# EAGLE design TutorialA (EAGLE 7.3.0)
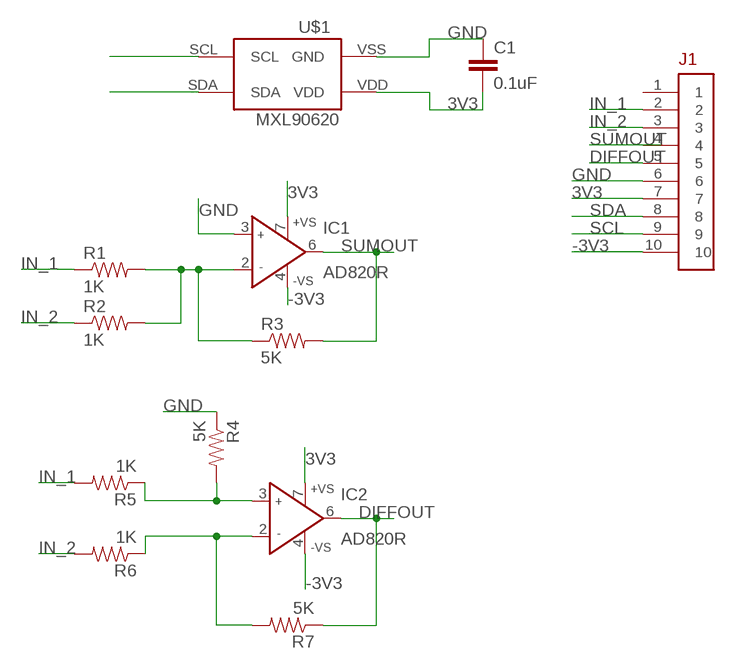
[diagram p0: schematic, sheet 1]

## Parts
C1  0.1uF  CAP0805  [0805]
IC1  AD820R  [SO8]
IC2  AD820R  [SO8]
J1  M50-3120545  [10PINFEMALE]
R1  1K  RESISTOR  [0805]
R2  1K  RESISTOR  [0805]
R3  5K  RESISTOR  [0805]
R4  5K  RESISTOR  [0805]
R5  1K  RESISTOR  [0805]
R6  1K  RESISTOR  [0805]
R7  5K  RESISTOR  [0805]
U$1  MXL90620  [MXL90620]

## Nets
3V3: C1.2 IC1.7(+VS) IC2.7(+VS) J1.7 U$1.VDD
-3V3: IC1.4(-VS) IC2.4(-VS) J1.10
DIFFOUT: IC2.6(OUT) J1.5 R7.1
GND: C1.1 IC1.3(IN+) J1.6 R4.1 U$1.VSS(GND)
IN_1: J1.2 R1.1 R5.2
IN_2: J1.3 R2.1 R6.2
N$1: IC1.2(IN-) R1.2 R2.2 R3.1
N$2: IC2.3(IN+) R4.2 R5.1
N$3: IC2.2(IN-) R6.1 R7.2
SCL: J1.9 U$1.SCL
SDA: J1.8 U$1.SDA
SUMOUT: IC1.6(OUT) R3.2
Unconnected: J1.1 J1.4

## Library data of the parts
C1 = CNTRL_BOARD:CAP: Capacitor Standard 0603 ceramic capacitor, and 0.1" leaded capacitor.
IC1 IC2 = analog-devices:AD820: Single-Supply, Rail-to-Rail, Low Power, FET Input Op Amp Source: http://www.analog.com/static/imported-files/data_sheets/AD820.pdf; OC_FARNELL: 1838867; OC_NEWARK: unknown
J1 = LED_Driver_Board:M50-3120545
R1-R7 = CNTRL_BOARD:RESISTOR
U$1 = CNTRL_BOARD:MXL90620

## Board
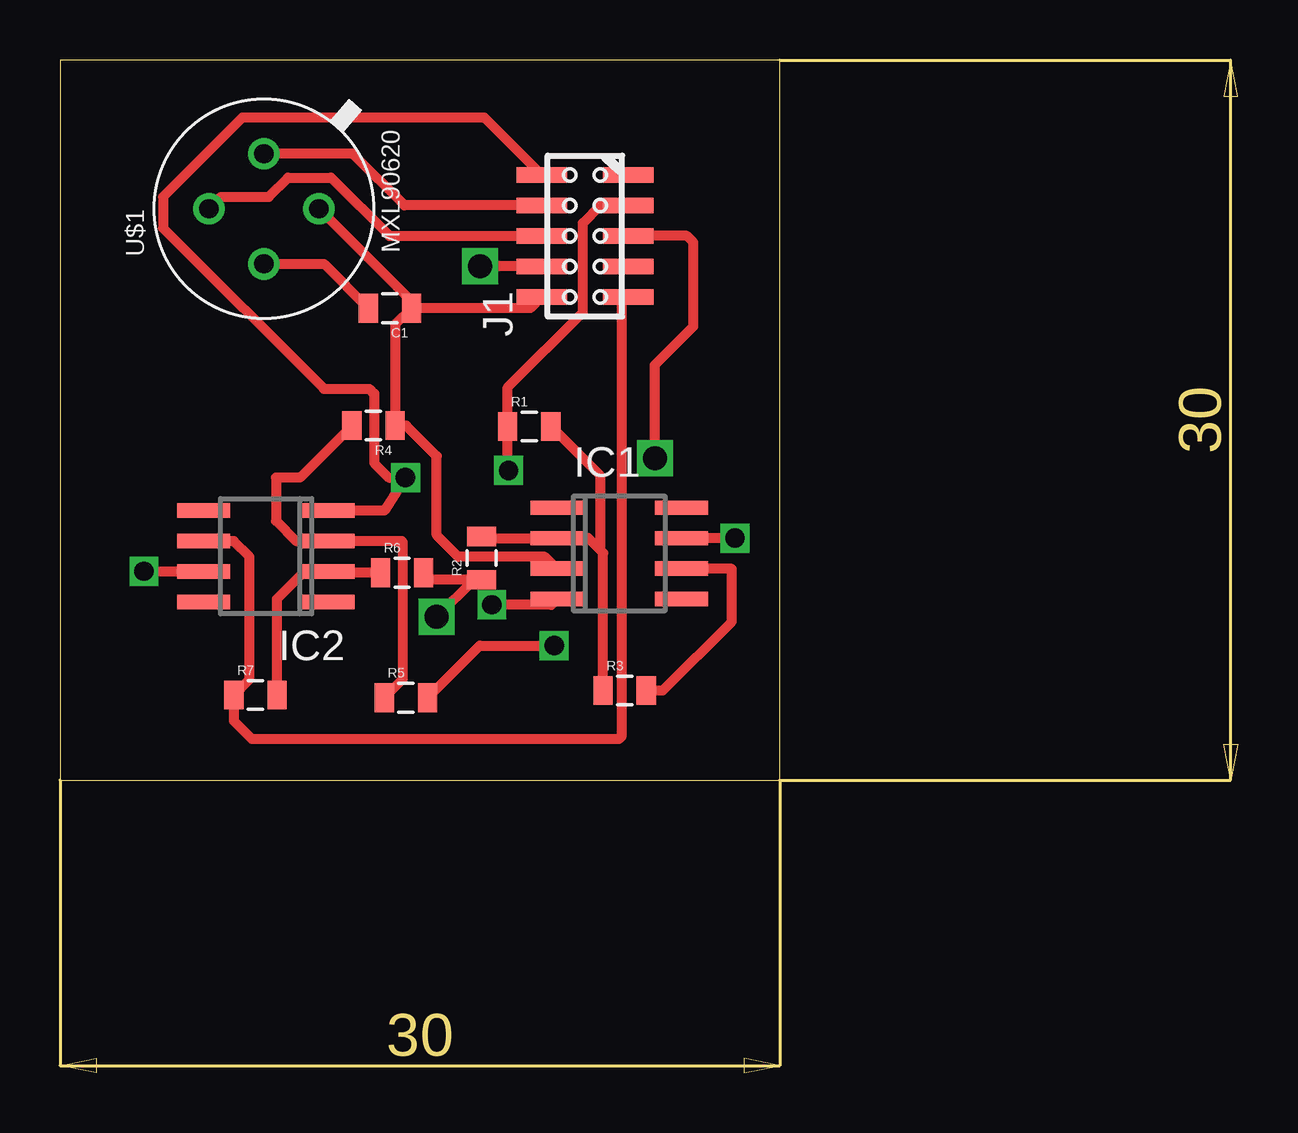
[diagram p1: board, top side]
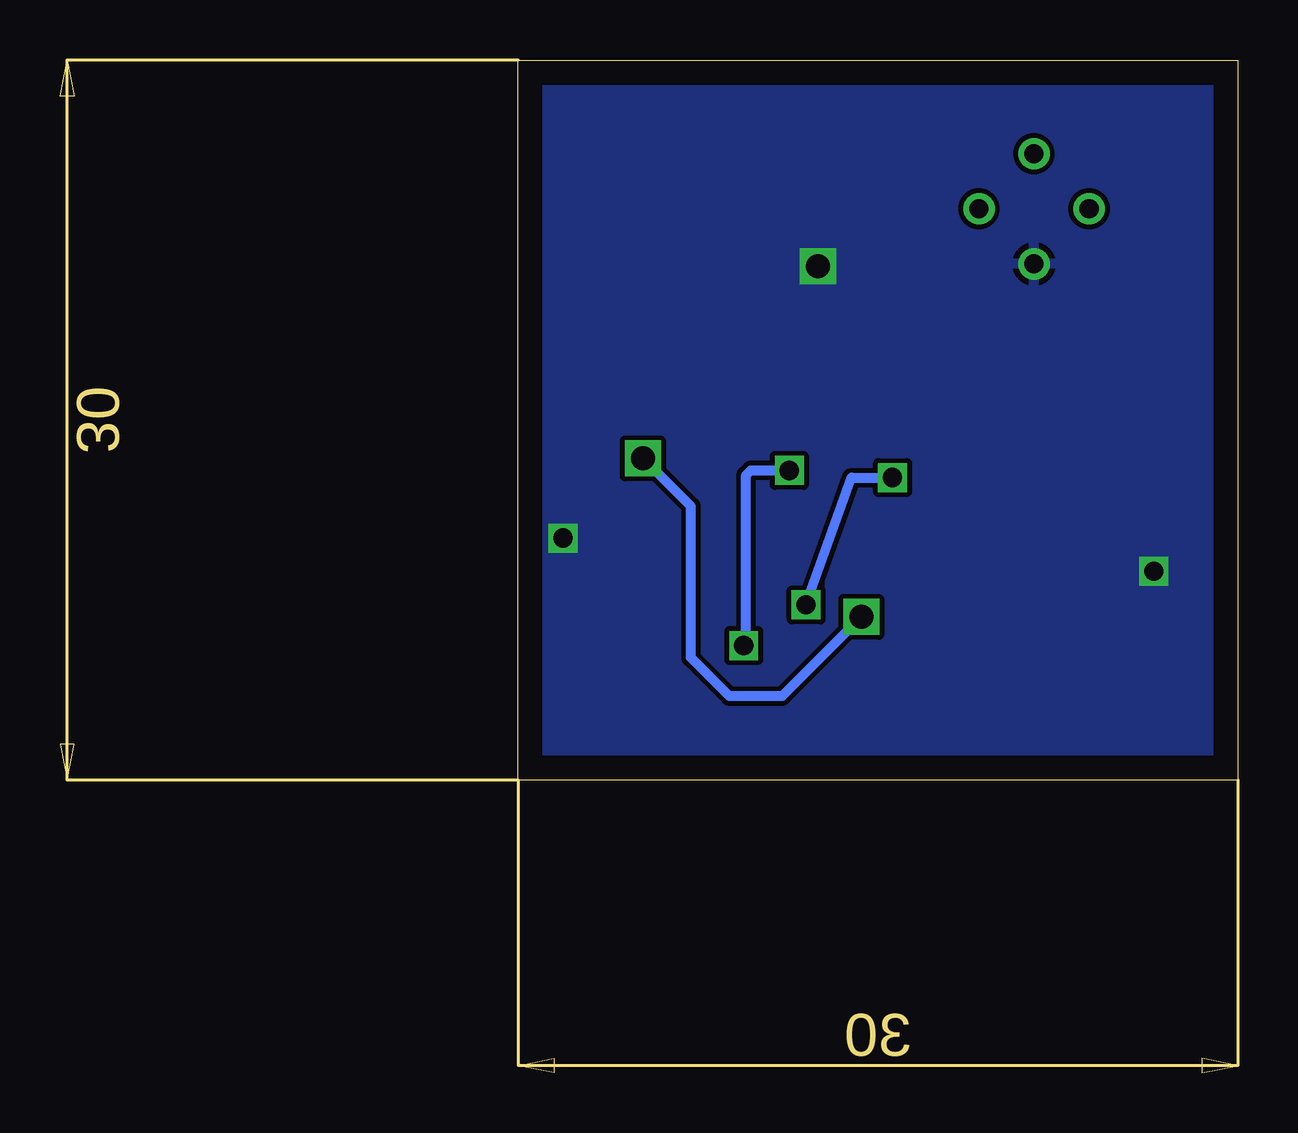
[diagram p2: board, bottom side, seen from below]

Size 30 x 30 mm. Coordinates in mm from the lower left corner, seen from the top.
Outline: 0,0 30,0 30,30 0,30 0,0
Copper layers (1*16): Top 0.035mm / dielectric 1.5mm / Bottom 0.035mm
Design rules "default": minimum track width 10mil, minimum drill 24mil, track to track 8mil, track to pad 8mil, pad to pad 8mil, via to via 8mil, smd to smd 8mil, copper to edge 40mil, drill to drill 8mil, minimum pad ring 10mil, minimum via ring 8mil, stop-mask expansion 4mil, vias tented up to drill 0mil, thermal gap 10mil

### Footprints (pad centres in the part's own frame; a part is rotated, then mirrored left to right if it is on the bottom)
0805 = smd 0.8 x 1.2: 1 -0.9,0; 2 0.9,0
SO8 = smd 0.6 x 2.2: 1 -1.905,-2.6; 2 -0.635,-2.6; 3 0.635,-2.6; 4 1.905,-2.6; 5 1.905,2.6; 6 0.635,2.6; 7 -0.635,2.6; 8 -1.905,2.6
10PINFEMALE = smd 0.65 x 2.1: 1 -2.54,1.8; 2 -1.27,1.8; 3 0,1.8; 4 1.27,1.8; 5 2.54,1.8; 6 2.54,-1.8; 7 1.27,-1.8; 8 0,-1.8; 9 -1.27,-1.8; 10 -2.54,-1.8
MXL90620 = drill 0.8: SCL 2.293,0; VDD -2.293,0; VSS 0,-2.294 | drill 0.8 pad 1.2: SDA 0,2.294

### Placement (x,y rotation side)
C1  13.75,19.66 180 top
IC1  23.31,9.44 270 top
IC2  8.59,9.32 90 top
J1  21.88,22.67 270 top
R1  19.56,14.73 0 top
R2  17.57,9.25 90 top
R3  23.54,3.73 0 top
R4  13.07,14.77 180 top
R5  14.42,3.43 0 top
R6  14.26,8.64 0 top
R7  8.15,3.54 0 top
U$1  8.5,23.8 90 top

### Tracks (layer width: path | path; a pad name or v marks a point on that pad's centre or on a via)
3V3  (via drill 0.8, 1)
  Top 0.406: v3.5,8.7 IC2.7 | v28.13,10.08 IC1.7 | U$1.VDD 11,21.51 C1.2 | J1.7 v17.5,21.4
  pour Bottom: 32.4,31.8 32.4,-2.5 -1.2,-2.5 -1.1,31.7
-3V3  (via drill 0.8)
  Top 0.406: IC1.4 20.48,7.3 v18,7.3 | IC2.4 13.53,11.22 v14.4,12.6 13.7,12.6 13.1,13.2 13.1,16.1 12.9,16.3 11,16.3 4.3,23 4.3,24.3 7.6,27.6 17.69,27.6 J1.10
  Bottom 0.406: v18,7.3 16.1,12.6 v14.4,12.6
DIFFOUT
  Top 0.406: IC2.6 7.25,9.96 7.9,9.3 7.9,4.19 R7.1 7.25,2.45 8,1.7 23.3,1.7 23.4,1.8 23.4,19.85 J1.5
GND
  Top 0.406: J1.6 19.61,19.66 C1.1 | U$1.VSS 14.65,19.94 C1.1 | C1.1 13.97,18.98 R4.1 14.43,14.77 15.7,13.5 15.7,10.2 16.6,9.3 20.21,9.3 IC1.3
IN_1  (via drill 0.8)
  Top 0.406: R5.2 17.49,5.6 v20.6,5.6 | v18.7,12.9 18.66,12.94 R1.1 18.66,16.36 21.8,19.5 21.8,23.2 22.54,23.94 J1.2
  Bottom 0.406: v20.6,5.6 20.5,5.7 20.5,12.7 20.3,12.9 v18.7,12.9
IN_2  (via drill 1)
  Top 0.406: R6.2 15.45,8.35 R2.1 17.25,8.35 v15.7,6.8 | v24.8,13.4 24.8,17.3 26.4,18.9 26.4,22.4 26.13,22.67 J1.3
  Bottom 0.406: v15.7,6.8 19,3.5 21.2,3.5 22.8,5.1 22.8,11.4 v24.8,13.4
N$1
  Top 0.406: R3.1 22.64,9.46 22.5,9.6 | 22.5,9.6 22.02,10.07 IC1.2 17.64,10.07 R2.2 | R1.2 22.5,12.69 22.5,9.6
N$2
  Top 0.406: R4.2 10,12.6 9,12.6 9,10.8 9.85,9.96 IC2.3 14.24,9.96 14.3,9.9 14.3,4.21 R5.1
N$3
  Top 0.406: R6.1 11.23,8.64 IC2.2 10.19,8.69 9.05,7.55 R7.2
SCL
  Top 0.406: J1.9 14.36,23.94 12.2,26.1 U$1.SCL
SDA
  Top 0.406: U$1.SDA 6.71,24.3 8.7,24.3 9.5,25.1 11.3,25.1 13.73,22.67 J1.8
SUMOUT
  Top 0.406: R3.2 25.13,3.73 28,6.6 28,8.8 IC1.6

### Text on the board
Document: Tutorial Board V1.0
bDocu: Tyler Fox